# Altium project PCB_Project1.PrjPCB
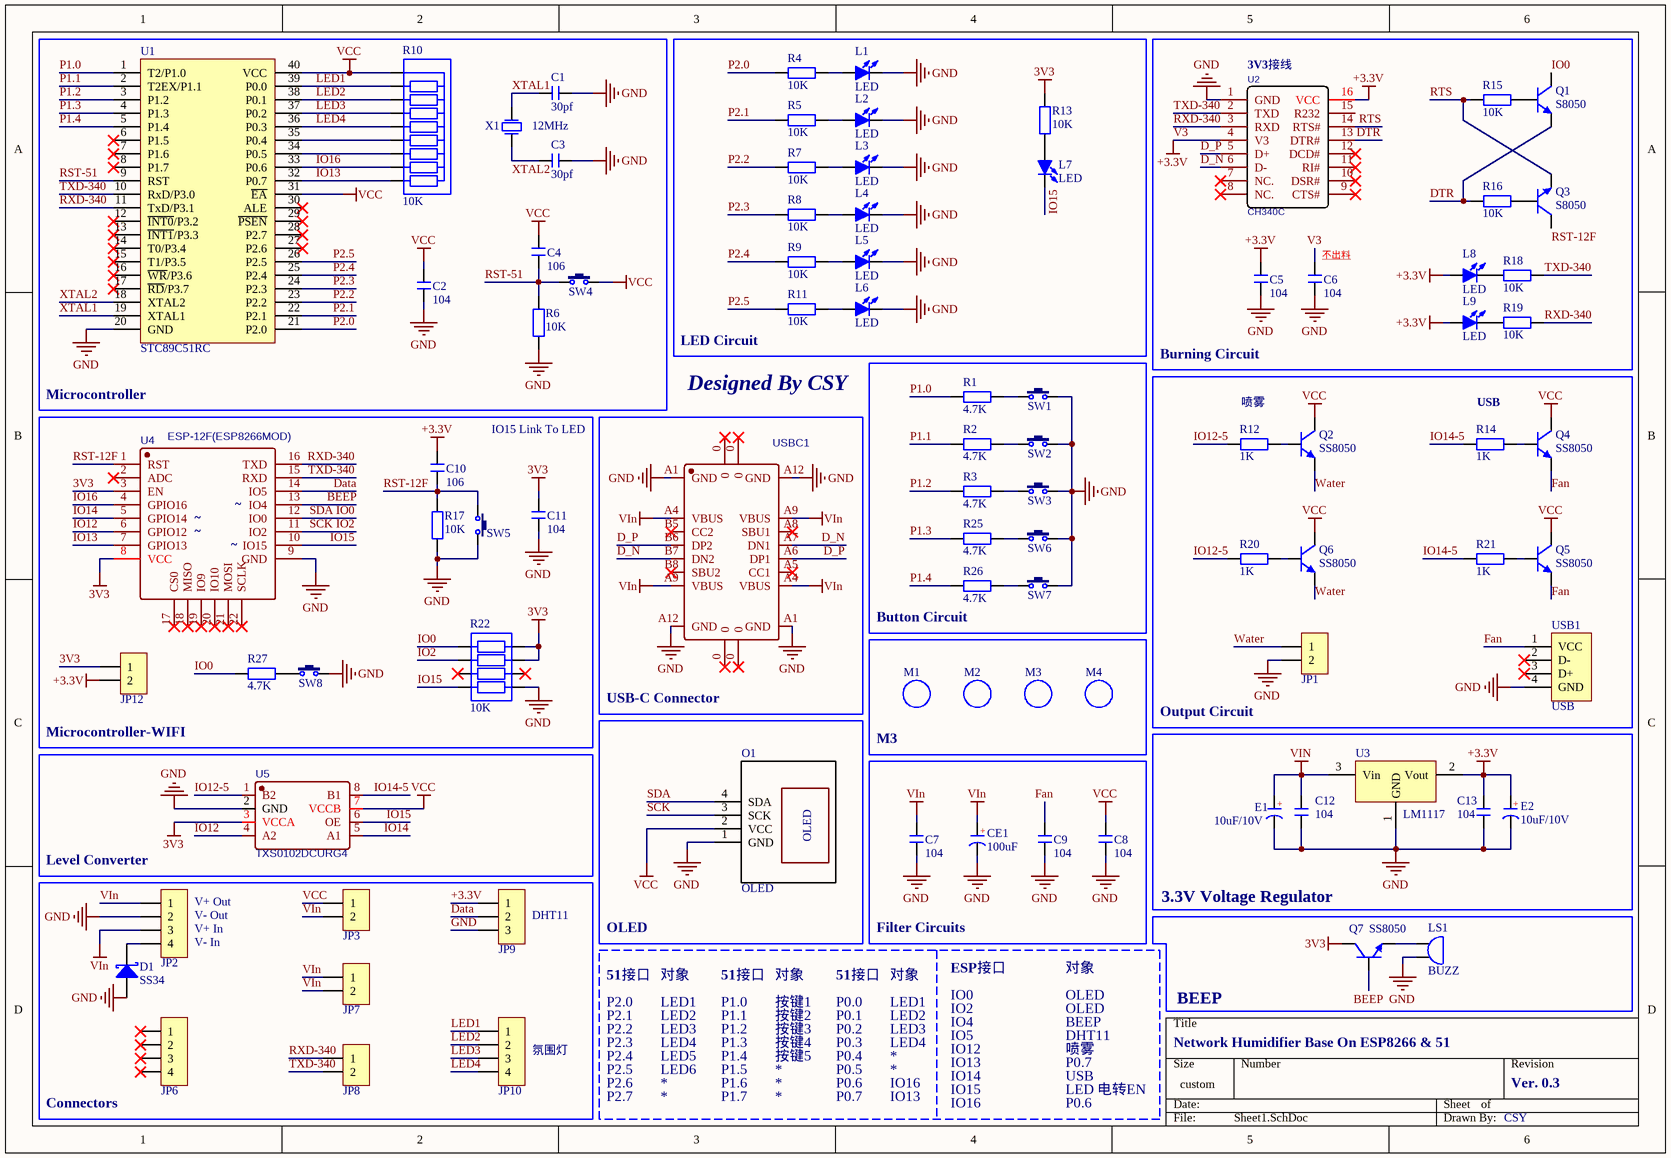
[diagram p0: Sheet1.SchDoc]
2 sheets, 117 parts. Net scope: global (net labels, ports and power ports of the same name join across sheets).
Board files: PCB1.PcbDoc, PCB2.PcbDoc
Sheets:
  Sheet1.SchDoc
  Sheet2.SchDoc

## Sheet Sheet1.SchDoc
size 312 x 215 mm

### Parts
C1  30pf  [C 0805_M]
C2  104  [C 0805_M]
C3  30pf  [C 0805_M]
C4  106  [C 0805_M]
C5  104  [C 0805_M]
C6  104  [C 0805_M]
C7  104  [C 0805_M]
C8  104  [C 0805_M]
C9  104  [C 0805_M]
C10  106  [C 0805_M]
C11  104  [C 0805_M]
C12  104  [C 0805_M]
C13  104  [C 0805_M]
CE1  100uF  [CM D(6.3*7.7)]
D1  SS34  [SMA]
E1  10uF/10V  [CD A(3216)]
E2  10uF/10V  [CD A(3216)]
JP1  HDR-1X2  [HDR2.54-LI-2P]  (value not drawn)
JP2  HDR-1X4  [HDR2.54-LI-4P]  (value not drawn)
JP3  HDR-1X2  [HDR2.54-LI-2P]  (value not drawn)
JP6  HDR-1X4  [HDR2.54-LI-4P]  (value not drawn)
JP7  HDR-1X2  [HDR2.54-LI-2P]  (value not drawn)
JP8  HDR-1X2  [HDR2.54-LI-2P]  (value not drawn)
JP9  HDR-1X3  [HDR2.54-M-LI-3P]  (value not drawn)
JP10  HDR-1X4  [HDR2.54-LI-4P]  (value not drawn)
JP12  HDR-1X2  [HDR2.54-LI-2P]  (value not drawn)
L1  LED  [LED 0805B]
L2  LED  [LED 0805R]
L3  LED  [LED 0805R]
L4  LED  [LED 0805R]
L5  LED  [LED 0805R]
L6  LED  [LED 0805G]
L7  LED  [LED 0805G]
L8  LED  [LED 0805G]
L9  LED  [LED 0805G]
LS1  BUZZ  [MLT-5020-1]
M1  M3  [M3x20_N]  (value not drawn)
M2  M3  [M3x20_N]  (value not drawn)
M3  M3  [M3x20_N]  (value not drawn)
M4  M3  [M3x20_N]  (value not drawn)
O1  OLED  [OLED]
Q1  S8050  [SOT23-3M]
Q2  SS8050  [SOT23-3M]
Q3  S8050  [SOT23-3M]
Q4  SS8050  [SOT23-3M]
Q5  SS8050  [SOT23-3M]
Q6  SS8050  [SOT23-3M]
Q7  SS8050  [SOT23-3M]
R1  4.7K  [R 0805_M]
R2  4.7K  [R 0805_M]
R3  4.7K  [R 0805_M]
R4  10K  [R 0805_M]
R5  10K  [R 0805_M]
R6  10K  [R 0805_M]
R7  10K  [R 0805_M]
R8  10K  [R 0805_M]
R9  10K  [R 0805_M]
R10  10K  [R SIP9-2.54]
R11  10K  [R 0805_M]
R12  1K  [R 0805_M]
R13  10K  [R 0805_M]
R14  1K  [R 0805_M]
R15  10K  [R 0805_M]
R16  10K  [R 0805_M]
R17  10K  [R 0805_M]
R18  10K  [R 0805_M]
R19  10K  [R 0805_M]
R20  1K  [R 0805_M]
R21  1K  [R 0805_M]
R22  10K  [RCA-8P4R-0603]
R25  4.7K  [R 0805_M]
R26  4.7K  [R 0805_M]
R27  4.7K  [R 0805_M]
SW1  3x6x5  [TSW SMD-3*6*2.5]  (value not drawn)
SW2  3x6x5  [TSW SMD-3*6*2.5]  (value not drawn)
SW3  3x6x5  [TSW SMD-3*6*2.5]  (value not drawn)
SW4  3x6x5  [TSW SMD-3*6*2.5]  (value not drawn)
SW5  3x6x5  [TSW SMD-3*6*2.5]  (value not drawn)
SW6  3x6x5  [TSW SMD-3*6*2.5]  (value not drawn)
SW7  3x6x5  [TSW SMD-3*6*2.5]  (value not drawn)
SW8  3x6x5  [TSW SMD-3*6*2.5]  (value not drawn)
U1  STC89C51RC  [DIP40-600_MH]
U2  CH340C  [SOP16_M]
U3  LM1117  [SOT223_M]
U4  ESP-12F(ESP8266MOD)  [ESP-12F_JX]
U5  TXS0102DCURG4  [VSSOP-8_L2.4-W2.1-P0.50-LS3.2-BL]
USB1  USB  [USB-A/S_D]
USBC1  TYPE-C-31-M-12  [USB-TYPE-C-R]  (value not drawn)
X1  12MHz  [OSC HC-49SMD]

### Blocks framed on the sheet
Microcontroller: C1-C4 R6 R10 SW4 U1 X1
LED Circuit: L1-L7 R4 R5 R7-R9 R11 R13
Burning Circuit: C5 C6 L8 L9 Q1 Q3 R15 R16 R18 R19 U2
Button Circuit: R1-R3 R25 R26 SW1-SW3 SW6 SW7
USB-C Connector: USBC1
Output Circuit: JP1 Q2 Q4-Q6 R12 R14 R20 R21 USB1
3.3V Voltage Regulator: C12 C13 E1 E2 U3
BEEP: LS1 Q7

### Nets
3V3: C11.2 JP12.1 Q7.3(C) R13.2 R22.7 R22.8 U4.3(EN) U4.8(VCC) U5.3(VCCA)
+3.3V: C5.2 C6.2 C10.2 C13.1 E2.1(A) JP9.1 JP12.2 L8.1(A) L9.1(A) U2.4(V3) U2.16(VCC) U3.2(Vout)  [also labelled V3]
GND: C1.2 C2.1 C3.2 C5.1 C6.1 C7.1 C8.1 C9.1 C11.1 C12.2 C13.2 CE1.2(K) D1.1(A) E1.2(K) E2.2(K) JP1.2 JP2.2 JP9.3 L1.2(K) L2.2(K) L3.2(K) L4.2(K) L5.2(K) L6.2(K) LS1.2 O1.1(GND) R6.1 R17.1 R22.5 SW1.2 SW2.2 SW3.2 SW5.2 SW6.2 SW7.2 SW8.2 U1.20(GND) U2.1(GND) U3.1(GND) U3.4(GND) U4.9(GND) U5.2(GND) USB1.4(GND) USBC1.A1(GND) USBC1.A12(GND)
VCC: C2.2 C4.2 C8.2 JP3.1 O1.2(VCC) Q2.3(C) Q4.3(C) Q5.3(C) Q6.3(C) R10.1 SW4.2 U1.31(~{EA}) U1.40(VCC) U5.7(VCCB)
VIn: C7.2 C12.1 CE1.1(A) E1.1(A) JP2.1 JP2.3 JP3.2 JP7.1 JP7.2 U3.3(Vin) USBC1.A4(VBUS) USBC1.A9(VBUS)
BEEP: Q7.1(B) U4.13(IO4)
D_N: U2.6(D-) USBC1.A7(DN1) USBC1.B7(DN2)
D_P: U2.5(D+) USBC1.A6(DP1) USBC1.B6(DP2)
Data: JP9.2 U4.14(IO5)
DTR: Q1.2(E) R16.2 U2.13(DTR#)
Fan: C9.2 Q4.2(E) Q5.2(E) USB1.1(VCC)
IO0: O1.4(SDA) Q1.3(C) R22.1 R27.2 U4.12(IO0)  [also labelled SDA]
IO2: O1.3(SCK) R22.2 U4.11(IO2)  [also labelled SCK]
IO12: U4.6(GPIO12) U5.4(A2)
IO12-5: R12.2 R20.2 U5.1(B2)
IO13: R10.9 U1.32(P0.7) U4.7(GPIO13)
IO14: U4.5(GPIO14) U5.5(A1)
IO14-5: R14.2 R21.2 U5.8(B1)
IO15: L7.2(K) R22.4 U4.10(IO15) U5.6(OE)
IO16: R10.8 U1.33(P0.6) U4.4(GPIO16)
LED1: JP10.1 R10.2 U1.39(P0.0)
LED2: JP10.2 R10.3 U1.38(P0.1)
LED3: JP10.3 R10.4 U1.37(P0.2)
LED4: JP10.4 R10.5 U1.36(P0.3)
P1.0: R1.2 U1.1(T2/P1.0)
P1.1: R2.2 U1.2(T2EX/P1.1)
P1.2: R3.2 U1.3(P1.2)
P1.3: R25.2 U1.4(P1.3)
P1.4: R26.2 U1.5(P1.4)
P2.0: R4.2 U1.21(P2.0)
P2.1: R5.2 U1.22(P2.1)
P2.2: R7.2 U1.23(P2.2)
P2.3: R8.2 U1.24(P2.3)
P2.4: R9.2 U1.25(P2.4)
P2.5: R11.2 U1.26(P2.5)
RST-12F: C10.1 Q3.3(C) R17.2 SW5.1 U4.1(RST)
RST-51: C4.1 R6.2 SW4.1 U1.9(RST)
RTS: Q3.2(E) R15.2 U2.14(RTS#)
RXD-340: JP8.1 R19.1 U1.11(TxD/P3.1) U2.3(RXD) U4.16(TXD)
TXD-340: JP8.2 R18.1 U1.10(RxD/P3.0) U2.2(TXD) U4.15(RXD)
Water: JP1.1 Q2.2(E) Q6.2(E)
XTAL1: C1.1 U1.19(XTAL1) X1.2
XTAL2: C3.1 U1.18(XTAL2) X1.1
NetD1_2: D1.2(K) JP2.4
NetL1_1: L1.1(A) R4.1
NetL2_1: L2.1(A) R5.1
NetL3_1: L3.1(A) R7.1
NetL4_1: L4.1(A) R8.1
NetL5_1: L5.1(A) R9.1
NetL6_1: L6.1(A) R11.1
NetL7_1: L7.1(A) R13.1
NetL8_2: L8.2(K) R18.2
NetL9_2: L9.2(K) R19.2
NetLS1_1: LS1.1 Q7.2(E)
NetQ1_1: Q1.1(B) R15.1
NetQ2_1: Q2.1(B) R12.1
NetQ3_1: Q3.1(B) R16.1
NetQ4_1: Q4.1(B) R14.1
NetQ5_1: Q5.1(B) R21.1
NetQ6_1: Q6.1(B) R20.1
NetR1_1: R1.1 SW1.1
NetR2_1: R2.1 SW2.1
NetR3_1: R3.1 SW3.1
NetR10_6: R10.6 U1.35(P0.4)
NetR10_7: R10.7 U1.34(P0.5)
NetR25_1: R25.1 SW6.1
NetR26_1: R26.1 SW7.1
NetR27_1: R27.1 SW8.1

Not connected (* = marked no-connect by the designer): JP6 1* 2* 3* 4*; R22 3* 6*; U1 6(P1.5)* 7(P1.6)* 8(P1.7)* 12(~{INT0}/P3.2)* 13(~{INT1}/P3.3)* 14(T0/P3.4)* 15(T1/P3.5)* 16(~{WR}/P3.6)* 17(~{RD}/P3.7)* 27(P2.6)* 28(P2.7)* 29(~{PSEN})* 30(ALE)*; U2 7(NC.)* 8(NC.)* 9(CTS#)* 10(DSR#)* 11(RI#)* 12(DCD#)* 15(R232); U4 2(ADC)* 17(CS0)* 18(MISO)* 19(IO9)* 20(IO10)* 21(MOSI)* 22(SCLK)*; USB1 2(D-)* 3(D+)*; USBC1 0* A5(CC1)* A8(SBU1)* B5(CC2)* B8(SBU2)*

### Notes on the sheet
- (near U2) 3V3接线
- (near C6) 不出料
- IO15 Link To LED
- Designed By CSY
- 喷雾
- USB
- (near U4) ~
- (near JP12) Microcontroller-WIFI
- (near M1) M3
- (near JP2) Level Converter
- (near JP2) V+ Out
- (near JP2) V- Out
- (near JP2) V+ In
- (near JP2) V- In
- (near JP9) DHT11
- OLED
- Filter Circuits
- ESP接口
- 对象
- 51接口
- P2.0
- P2.1
- P2.2
- P2.3
- LED1
- LED2
- LED3
- LED4
- P1.0
- P1.1
- P1.2
- P1.3
- 按键1
- 按键2
- 按键3
- 按键4
- P0.0
- P0.1
- P0.2
- P0.3
- IO0
- IO2
- IO4
- IO5
- BEEP
- DHT11
- Network Humidifier Base On ESP8266 & 51
- (near JP6) Connectors
- (near JP10) 氛围灯
- P2.4
- P2.5
- P2.6
- P2.7
- *
- LED5
- LED6
- P1.4
- P1.5
- P1.6
- P1.7
- 按键5
- P0.4
- P0.5
- P0.6
- P0.7
- IO13
- IO16
- IO12
- IO14
- IO15
- LED 电转EN
- Ver. 0.3
- CSY
- (in symbol CE_SMD) +
- (in symbol CT) +

### Library data of the parts
C1-C13 = C: 贴片电容; 淘宝ID: 小糖豆的小窝窝; BOM名称: 贴片电容; 下单链接: https://item.taobao.com/item.htm?ft=t&id=613637044352
CE1 = CE_SMD: 贴片电解电容; 淘宝ID: 小糖豆的小窝窝; BOM名称: 贴片电解电容; 下单链接: https://item.taobao.com/item.htm?ft=t&id=613637044352
D1 = SS34: 肖特基二极管; 淘宝ID: 小糖豆的小窝窝; BOM名称: 肖特基二极管; 下单链接: https://item.taobao.com/item.htm?ft=t&id=613637044352
E1 E2 = CT: 贴片钽电容; 淘宝ID: 小糖豆的小窝窝; BOM名称: 贴片钽电容; 下单链接: https://item.taobao.com/item.htm?ft=t&id=613637044352
JP1 JP3 JP7 JP8 JP12 = Header 2: 2P接插件; 淘宝ID: 小糖豆的小窝窝; BOM名称: 2P接插件; 下单链接: https://item.taobao.com/item.htm?ft=t&id=613637044352
JP2 JP6 JP10 = Header 4: 4P接插件; 淘宝ID: 小糖豆的小窝窝; BOM名称: 4P接插件; 下单链接: https://item.taobao.com/item.htm?ft=t&id=613637044352
JP9 = Header 3: 3P接插件; 淘宝ID: 小糖豆的小窝窝; BOM名称: 3P接插件; 下单链接: https://item.taobao.com/item.htm?ft=t&id=613637044352
L1-L9 = LED: 发光二极管; 淘宝ID: 小糖豆的小窝窝; BOM名称: 发光二极管; 下单链接: https://item.taobao.com/item.htm?ft=t&id=613637044352
LS1 = BUZZ: 蜂鸣器; 淘宝ID: 小糖豆的小窝窝; BOM名称: 蜂鸣器; 下单链接: https://item.taobao.com/item.htm?ft=t&id=613637044352
M1-M4 = M3: 铜柱孔; 淘宝ID: 小糖豆的小窝窝; BOM名称: 铜柱孔; 下单链接: https://item.taobao.com/item.htm?ft=t&id=613637044352
Q1-Q7 = 8050-SMD: 高频放大-NPN型; 淘宝ID: 小糖豆的小窝窝; BOM名称: 高频放大-NPN型; 下单链接: https://item.taobao.com/item.htm?ft=t&id=613637044352
R1-R9 R11-R21 R25-R27 = R: 贴片电阻; 淘宝ID: 小糖豆的小窝窝; BOM名称: 贴片电阻; 下单链接: https://item.taobao.com/item.htm?ft=t&id=613637044352
R10 = R SIP9: 9脚直插排阻; 淘宝ID: 小糖豆的小窝窝; BOM名称: 9脚直插排阻; 下单链接: https://item.taobao.com/item.htm?ft=t&id=613637044352
R22 = R-8P4R: 贴片排阻; 淘宝ID: 小糖豆的小窝窝; BOM名称: 贴片排阻; 下单链接: https://item.taobao.com/item.htm?ft=t&id=613637044352
SW1-SW8 = TSW 3x6: 3x6轻触开关; 淘宝ID: 小糖豆的小窝窝; BOM名称: 3x6轻触开关; 下单链接: https://item.taobao.com/item.htm?ft=t&id=613637044352
U1 = STC89C51RC: STC单片机; 淘宝ID: 小糖豆的小窝窝; BOM名称: STC单片机; Alias1: https://item.taobao.com/item.htm?ft=t&id=613637044352
U2 = CH340C: BOM_Manufacturer: WCH; SMT Type: Extend; BOM_Supplier: LCSC; BOM_Manufacturer Part: CH340C; BOM_Supplier Part: C84681; BOM_LCSC Assembly: Yes; spicePre: U; spiceSymbolName: CH340C
U3 = LM1117: 三端稳压芯片; 淘宝ID: 小糖豆的小窝窝; BOM名称: 三端稳压芯片; 下单链接: https://item.taobao.com/item.htm?ft=t&id=613637044352
U4 = ESP-12F(ESP8266MOD): BOM_Manufacturer: Ai-Thinker; BOM_Supplier: LCSC; BOM_Manufacturer Part: ESP-12F(ESP8266MOD); BOM_Supplier Part: C82891; BOM_JLCPCB Part Class: Extended Part; spicePre: U; spiceSymbolName: ESP-12F(ESP8266MOD)
U5 = TXS0102DCURG4: 电平转换; BOM_Manufacturer: TI(德州仪器); Contributor: LCSC; BOM_Supplier: LCSC; BOM_Supplier Part: C2677454; BOM_Manufacturer Part: TXS0102DCURG4; BOM_JLCPCB Part Class: Extended Part; spicePre: U; spiceSymbolName: TXS0102DCURG4
USB1 = USB-A/S: USB-A型母接口; 淘宝ID: 小糖豆的小窝窝; BOM名称: USB-A型母接口; 下单链接: https://item.taobao.com/item.htm?ft=t&id=613637044352
USBC1 = TYPE-C-31-M-12: Type-C母座; BOM_Manufacturer: Rectangular Connectors - Contacts; Contributor: LCSC; BOM_Supplier: LCSC; BOM_Supplier Part: C165948; BOM_Manufacturer Part: TYPE-C-31-M-12; spicePre: U; spiceSymbolName: TYPE-C-31-M-12
X1 = XTAL-2P: 2脚无源脚晶振; 淘宝ID: 小糖豆的小窝窝; BOM名称: 2脚无源脚晶振; 下单链接: https://item.taobao.com/item.htm?ft=t&id=613637044352

## Sheet Sheet2.SchDoc
size 152 x 101 mm
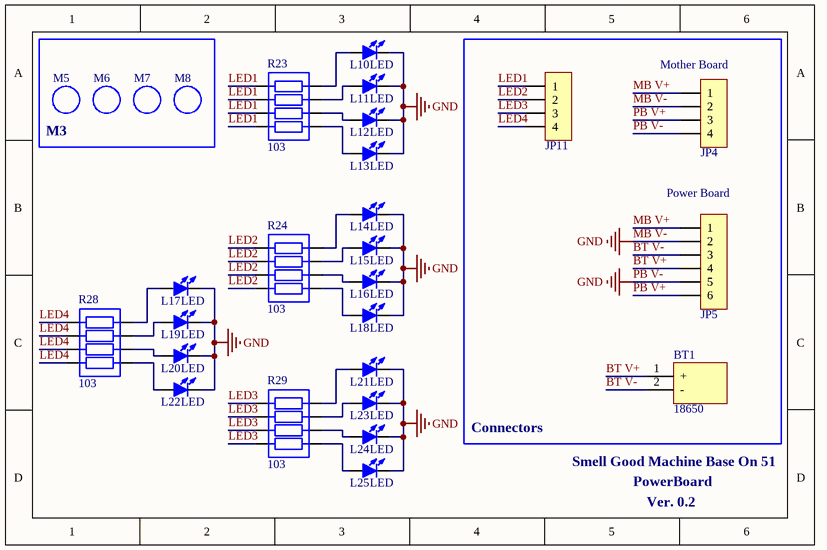
[diagram p1: Sheet2.SchDoc]

### Parts
BT1  18650  [18650_battery]
JP4  HDR-1X4  [HDR2.54-M-LI-4P]  (value not drawn)
JP5  HDR-1X6  [HDR2.54-M-LI-6P]  (value not drawn)
JP11  HDR-1X4  [HDR2.54-LI-4P]  (value not drawn)
L10  LED  [LED 0805G]
L11  LED  [LED 0805G]
L12  LED  [LED 0805G]
L13  LED  [LED 0805G]
L14  LED  [LED 0805G]
L15  LED  [LED 0805G]
L16  LED  [LED 0805G]
L17  LED  [LED 0805G]
L18  LED  [LED 0805G]
L19  LED  [LED 0805G]
L20  LED  [LED 0805G]
L21  LED  [LED 0805G]
L22  LED  [LED 0805G]
L23  LED  [LED 0805G]
L24  LED  [LED 0805G]
L25  LED  [LED 0805G]
M5  M3  [M3x20_N]  (value not drawn)
M6  M3  [M3x20_N]  (value not drawn)
M7  M3  [M3x20_N]  (value not drawn)
M8  M3  [M3x20_N]  (value not drawn)
R23  103  [RCA-8P4R-0603]
R24  103  [RCA-8P4R-0603]
R28  103  [RCA-8P4R-0603]
R29  103  [RCA-8P4R-0603]

### Blocks framed on the sheet
M3: M5-M8
Connectors: BT1 JP4 JP5 JP11

### Nets
GND: JP4.2 JP4.4 JP5.2 JP5.5 L10.2(K) L11.2(K) L12.2(K) L13.2(K) L14.2(K) L15.2(K) L16.2(K) L17.2(K) L18.2(K) L19.2(K) L20.2(K) L21.2(K) L22.2(K) L23.2(K) L24.2(K) L25.2(K)  [also labelled MB V-, PB V-]
BT V+: BT1.1(+) JP5.4
BT V-: BT1.2(-) JP5.3
LED1: JP11.1 R23.1 R23.2 R23.3 R23.4
LED2: JP11.2 R24.1 R24.2 R24.3 R24.4
LED3: JP11.3 R29.1 R29.2 R29.3 R29.4
LED4: JP11.4 R28.1 R28.2 R28.3 R28.4
MB V+: JP4.1 JP5.1
PB V+: JP4.3 JP5.6
NetL10_1: L10.1(A) R23.8
NetL11_1: L11.1(A) R23.7
NetL12_1: L12.1(A) R23.6
NetL13_1: L13.1(A) R23.5
NetL14_1: L14.1(A) R24.8
NetL15_1: L15.1(A) R24.7
NetL16_1: L16.1(A) R24.6
NetL17_1: L17.1(A) R28.8
NetL18_1: L18.1(A) R24.5
NetL19_1: L19.1(A) R28.7
NetL20_1: L20.1(A) R28.6
NetL21_1: L21.1(A) R29.8
NetL22_1: L22.1(A) R28.5
NetL23_1: L23.1(A) R29.7
NetL24_1: L24.1(A) R29.6
NetL25_1: L25.1(A) R29.5

### Notes on the sheet
- (near JP4) Mother Board
- (near JP5) Power Board
- Smell Good Machine Base On 51
- PowerBoard
- Ver. 0.2

### Library data of the parts
BT1 = 18650: Battery; 淘宝ID: 小糖豆的小窝窝; BOM名称: 18650; 下单链接: https://item.taobao.com/item.htm?ft=t&id=613637044352
JP4 JP11 = Header 4: 4P接插件; 淘宝ID: 小糖豆的小窝窝; BOM名称: 4P接插件; 下单链接: https://item.taobao.com/item.htm?ft=t&id=613637044352
JP5 = Header 6: 6P接插件; 淘宝ID: 小糖豆的小窝窝; BOM名称: 6P接插件; 下单链接: https://item.taobao.com/item.htm?ft=t&id=613637044352
L10-L25 = LED: 发光二极管; 淘宝ID: 小糖豆的小窝窝; BOM名称: 发光二极管; 下单链接: https://item.taobao.com/item.htm?ft=t&id=613637044352
M5-M8 = M3: 铜柱孔; 淘宝ID: 小糖豆的小窝窝; BOM名称: 铜柱孔; 下单链接: https://item.taobao.com/item.htm?ft=t&id=613637044352
R23 R24 R28 R29 = R-8P4R: 贴片排阻; 淘宝ID: 小糖豆的小窝窝; BOM名称: 贴片排阻; 下单链接: https://item.taobao.com/item.htm?ft=t&id=613637044352

## Nets that join several sheets
GND: Sheet1 (45 pins), Sheet2 (20 pins)
LED1: Sheet1 (JP10.1 R10.2 U1.39), Sheet2 (5 pins)
LED2: Sheet1 (JP10.2 R10.3 U1.38), Sheet2 (5 pins)
LED3: Sheet1 (JP10.3 R10.4 U1.37), Sheet2 (5 pins)
LED4: Sheet1 (JP10.4 R10.5 U1.36), Sheet2 (5 pins)